# Altium schematic sheet Circuit.SchDoc
size 420 x 297 mm; Scale: 1:1; DocumentType: Схема электрическая принципиальная; FirstReferrence: АБВГ.123456.001
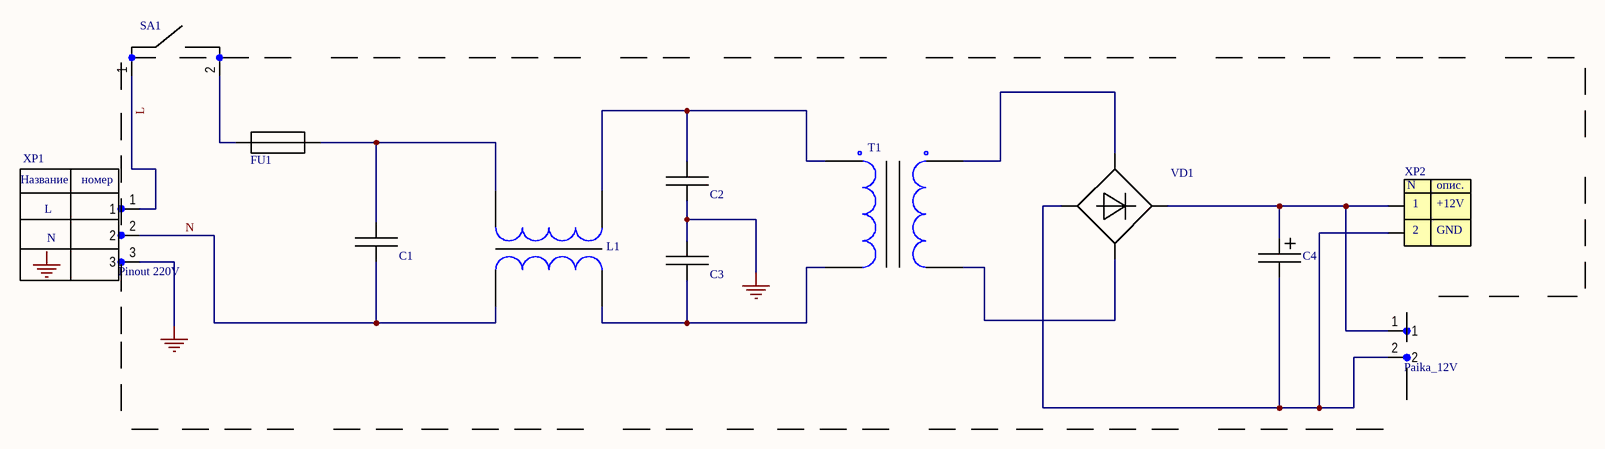
[diagram p0: Circuit.SchDoc]

## Parts
(Parts that share a designator on the sheet are numbered #1, #2 ... from top to bottom, then left to right.)
*#1  Pinout 220V  [Con_220]
*#2  Paika_12V  [Con_12]
C1  Capasitor  [KXP2220]  (value not drawn)
C2  Capasitor  [JN1]  (value not drawn)
C3  Capasitor  [JN1]  (value not drawn)
C4  Capasitor-electrical  [RD1H108M12025BB]  (value not drawn)
FU1  FU  [FU2A]  (value not drawn)
L1  Induction  [ET24]  (value not drawn)
SA1  переключатель  [Switcher]  (value not drawn)
T1  Transforms  [TransformIE48]  (value not drawn)
VD1  Most  [RC-407]  (value not drawn)
XP2  WB-2.0  [Con_5V]  (value not drawn)

## Nets
ETH: *#1.3 C2.2 C3.1
L: *#1.1 SA1.1
N: *#1.2 C1.2 L1.4
Net*#2_1: *#2.1 C4.1 VD1.1 XP2.1
Net*#2_2: *#2.2 C4.2 VD1.4 XP2.2
NetC1_1: C1.1 FU1.2 L1.1
NetC2_1: C2.1 L1.2 T1.1
NetC3_2: C3.2 L1.3 T1.6
NetFU1_1: FU1.1 SA1.2
NetT1_8: T1.8 VD1.2
NetT1_11: T1.11 VD1.3

## Notes on the sheet
- Название
- XP1
- L
- (near *#1) номер
- N
- Перв. примен.
- Справ. №
- Подп. и дата
- Инв. № дубл.
- Взам. инв. №
- Разраб.
- Изм.
- Лист
- № докум.
- Подп.
- Дата
- Лит.
- Масса
- Масштаб
- Пров.
- Т.контр.
- Листов
- Инв. № подл.
- Утв.
- Н.контр.
- 2.106-A3
- Копировал
- Формат А3
- (in symbol WB-2.0) N; опис.; +12V; GND

## Library data of the parts
*#1 = Connector_220V
*#2 = Conector_12V